# EAGLE design nucleo_board (EAGLE 9.6.2)
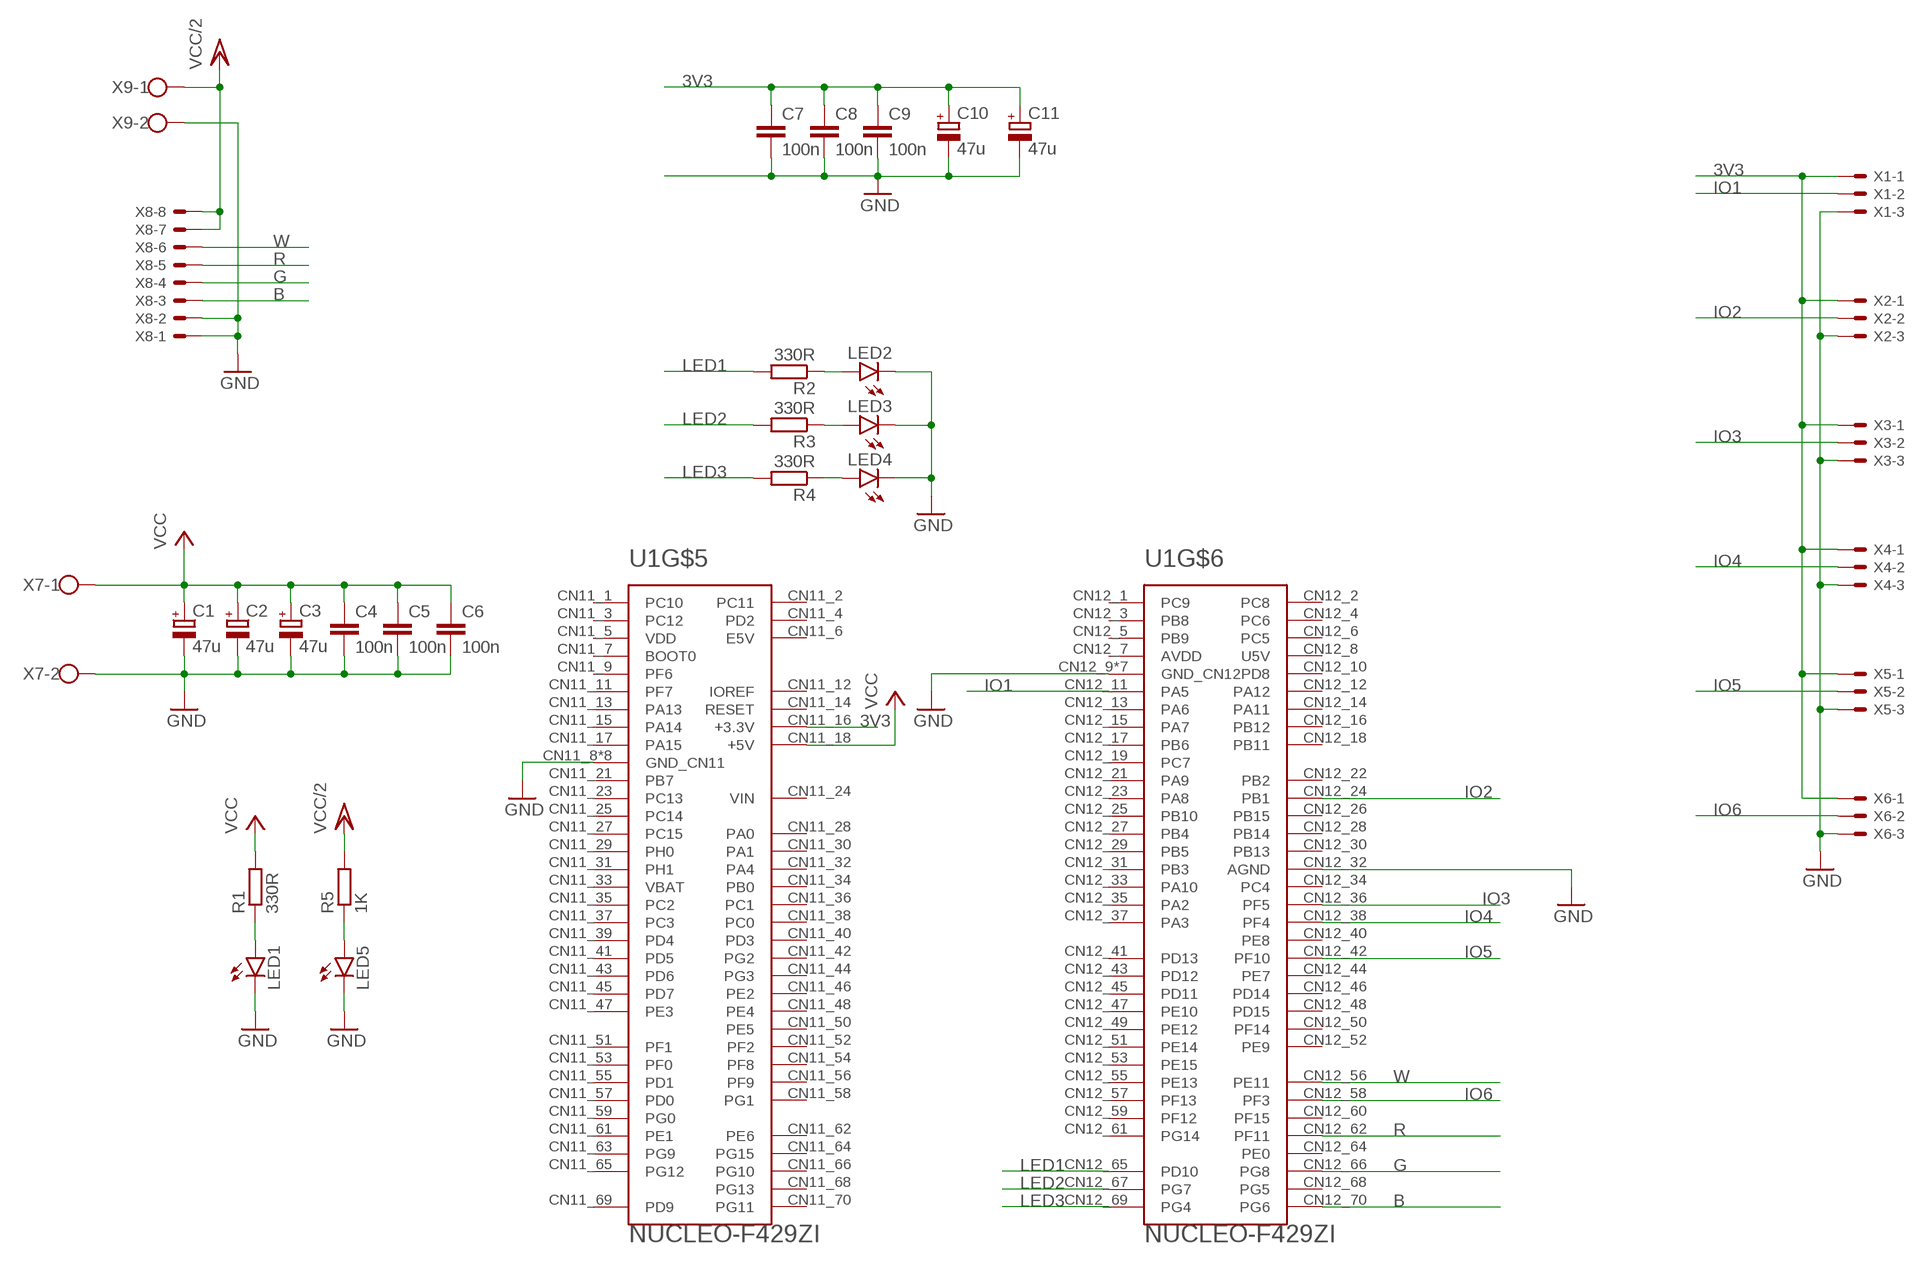
[diagram p0: schematic, sheet 1]

## Parts
C1  47u  CPOL-EU153CLV-1010  [153CLV-1010]
C2  47u  CPOL-EU153CLV-1010  [153CLV-1010]
C3  47u  CPOL-EU153CLV-1010  [153CLV-1010]
C4  100n  C-EUC1206  [C1206]
C5  100n  C-EUC1206  [C1206]
C6  100n  C-EUC1206  [C1206]
C7  100n  C-EUC1206  [C1206]
C8  100n  C-EUC1206  [C1206]
C9  100n  C-EUC1206  [C1206]
C10  47u  CPOL-EU153CLV-1010  [153CLV-1010]
C11  47u  CPOL-EU153CLV-1010  [153CLV-1010]
LED1  LEDCHIPLED_1206  [CHIPLED_1206]
LED2  LEDCHIPLED_1206  [CHIPLED_1206]
LED3  LEDCHIPLED_1206  [CHIPLED_1206]
LED4  LEDCHIPLED_1206  [CHIPLED_1206]
LED5  LEDCHIPLED_1206  [CHIPLED_1206]
R1  330R  R-EU_M1206  [M1206]
R2  330R  R-EU_M1206  [M1206]
R3  330R  R-EU_M1206  [M1206]
R4  330R  R-EU_M1206  [M1206]
R5  1K  R-EU_M1206  [M1206]
U1  NUCLEO-F429ZI  [MODULE_NUCLEO-F429ZI]
X1  KK-156-3  [KK-156-3]
X2  KK-156-3  [KK-156-3]
X3  KK-156-3  [KK-156-3]
X4  KK-156-3  [KK-156-3]
X5  KK-156-3  [KK-156-3]
X6  KK-156-3  [KK-156-3]
X7  W237-102  [W237-102]
X8  KK-156-8  [KK-156-8]
X9  W237-102  [W237-102]

## Nets
3V3: C7.1 C8.1 C9.1 C10.+ C11.+ U1.CN11_16(+3.3V) X1.1 X2.1 X3.1 X4.1 X5.1 X6.1
B: U1.CN12_70(PG6) X8.3
G: U1.CN12_66(PG8) X8.4
GND: C1.- C2.- C3.- C4.2 C5.2 C6.2 C7.2 C8.2 C9.2 C10.- C11.- LED1.C LED2.C LED3.C LED4.C LED5.C U1.CN11_8(GND_CN11) U1.CN11_19(GND_CN11) U1.CN11_20(GND_CN11) U1.CN11_22(GND_CN11) U1.CN11_49(GND_CN11) U1.CN11_60(GND_CN11) U1.CN11_71(GND_CN11) U1.CN11_72(GND_CN11) U1.CN12_9(GND_CN12) U1.CN12_20(GND_CN12) U1.CN12_32(AGND) U1.CN12_39(GND_CN12) U1.CN12_54(GND_CN12) U1.CN12_63(GND_CN12) U1.CN12_71(GND_CN12) U1.CN12_72(GND_CN12) X1.3 X2.3 X3.3 X4.3 X5.3 X6.3 X7.2 X8.1 X8.2 X9.2
IO1: U1.CN12_11(PA5) X1.2
IO2: U1.CN12_24(PB1) X2.2
IO3: U1.CN12_36(PF5) X3.2
IO4: U1.CN12_38(PF4) X4.2
IO5: U1.CN12_42(PF10) X5.2
IO6: U1.CN12_58(PF3) X6.2
LED1: R2.2 U1.CN12_65(PD10)
LED2: R3.2 U1.CN12_67(PG7)
LED3: R4.2 U1.CN12_69(PG4)
N$1: LED1.A R1.1
N$2: LED5.A R5.1
N$3: LED3.A R3.1
N$8: LED4.A R4.1
N$9: LED2.A R2.1
R: U1.CN12_62(PF11) X8.5
VCC: C1.+ C2.+ C3.+ C4.1 C5.1 C6.1 R1.2 U1.CN11_18(+5V) X7.1
VCC/2: R5.2 X8.7 X8.8 X9.1
W: U1.CN12_56(PE11) X8.6
Unconnected: U1.CN7_1(D16/PC6/I2S_A_MCK) U1.CN7_2(D15/PB8/I2C_A_SCL) U1.CN7_3(D17/PB15/I2S_A_SD) U1.CN7_4(D14/PB9/I2C_A_SDA) U1.CN7_5(D18/PB13/I2S_A_CK) U1.CN7_6(AVDD) U1.CN7_7(D19/PB12/I2S_A_WS) U1.CN7_8(GND_CN7) U1.CN7_9(D20/PA15/I2S_B_WS) U1.CN7_10(D13/PA5/SPI_A_SCK) U1.CN7_11(D21/PC7/I2S_B_MCK) U1.CN7_12(D12/PA6/SPI_A_MISO) U1.CN7_13(D22/PB5/I2S_B_SD/SPI_B_MOSI) U1.CN7_14(D11/ETH/PA7/SPI_A_MOSI/TIM_E_PWM1) U1.CN7_15(D23/PB3/I2S_B_CK/SPI_B_SCK) U1.CN7_16(D10/PD14/SPI_A_CS/TIM_B_PWM3) U1.CN7_17(D24/PA4/SPI_B_NSS) U1.CN7_18(D9/PD15/TIMER_B_PWM2) U1.CN7_19(D25/PB4/SPI_B_MISO) U1.CN7_20(D8/PF12) U1.CN8_2(D43/PC8/SDMMC_D0) U1.CN8_3(IOREF) U1.CN8_4(D44/PC9/SDMMC_D1/I2S_A_CKIN) U1.CN8_5(RESET) U1.CN8_6(D45/PC10/SDMMC_D2) U1.CN8_7(+3.3V) U1.CN8_8(D46/PC11/SDMMC_D3) U1.CN8_9(+5V) U1.CN8_10(D47/PC12/SDMMC_CK) U1.CN8_11(GND_CN8) U1.CN8_12(D48/PD2/SDMMC_CMD) U1.CN8_13(GND_CN8) U1.CN8_14(D49/PG2) U1.CN8_15(VIN) U1.CN8_16(D50/PG3) U1.CN9_1(A0/PA3) U1.CN9_2(D51/PD7/USART_B_SCLK) U1.CN9_3(A1/PC0) U1.CN9_4(D52/PD6/USART_B_RX) U1.CN9_5(A2/PC3) U1.CN9_6(D53/PD5/USART_B_TX) U1.CN9_7(A3/PF3) U1.CN9_8(D54/PD4/USART_B_RTS) U1.CN9_9(A4/PF5) U1.CN9_10(D55/PD3/USART_B_CTS) U1.CN9_11(A5/PF10) U1.CN9_12(GND_CN9) U1.CN9_13(D72/NC) U1.CN9_14(D56/PE2/SAI_A_MCLK) U1.CN9_15(D71/PA7) U1.CN9_16(D57/PE4/SAI_A_FS) U1.CN9_17(D70/PF2/I2C_B_SMBA) U1.CN9_18(D58/PE5/SAI_A_SCK) U1.CN9_19(D69/PF1/I2C_B_SCL) U1.CN9_20(D59/PE6/SAI_A_SD) U1.CN9_21(D68/PF0/I2C_B_SDA) U1.CN9_22(D60/PE3/SAI_B_SD) U1.CN9_23(GND_CN9) U1.CN9_24(D61/PF8/SAI_B_SCK) U1.CN9_25(D67/PD0/CAN_RX) U1.CN9_26(D62/PF7/SAI_B_MCLK) U1.CN9_27(D66/PD1/CAN_TX) U1.CN9_28(D63/PF9/SAI_B_FS) U1.CN9_29(D65/PG0) U1.CN9_30(D64/PG1) U1.CN10_1(AVDD) U1.CN10_2(D7/PF13) U1.CN10_3(AGND) U1.CN10_4(D6/PE9/TIMER_A_PWM1) U1.CN10_5(GND_CN10) U1.CN10_6(D5/PE11/TIMER_A_PWM2) U1.CN10_7(A6/PB1/ADC_A_IN) U1.CN10_8(D4/PF14) U1.CN10_9(A7/PC2/ADC_B_IN) U1.CN10_10(D3/PE13/TIMER_A_PWM3) U1.CN10_11(A8/PF4/ADC_C_IN) U1.CN10_12(D2/PF15) U1.CN10_13(D26/PB6) U1.CN10_14(D1/PG14/USART_A_TX) U1.CN10_15(D27/PB2) U1.CN10_16(D0/PG9/USART_A_RX) U1.CN10_17(GND_CN10) U1.CN10_18(D42/PE8/TIMER_A_PWM1N) U1.CN10_19(D28/PD13) U1.CN10_20(D41/PE7/TIMER_A_ETR) U1.CN10_21(D29/PD12) U1.CN10_22(GND_CN10) U1.CN10_23(D30/PD11) U1.CN10_24(D40/PE10/TIMER_A_PWM2N) U1.CN10_25(D31/PE2) U1.CN10_26(D39/PE12/TIMER_A_PWM3N) U1.CN10_27(GND_CN10) U1.CN10_28(D38/PE14) U1.CN10_29(D32/PA0/TIMER_C_PWM1) U1.CN10_30(D37/PE15/TIMER_A_BKIN1) U1.CN10_31(D33/PB0/TIMER_D_PWM1) U1.CN10_32(D36/PB10/TIMER_C_PWM2) U1.CN10_33(D34/PE0/TIMER_B_ETR) U1.CN10_34(D35/PB11/TIMER_C_PWM3) U1.CN11_1(PC10) U1.CN11_2(PC11) U1.CN11_3(PC12) U1.CN11_4(PD2) U1.CN11_5(VDD) U1.CN11_6(E5V) U1.CN11_7(BOOT0) U1.CN11_9(PF6) U1.CN11_11(PF7) U1.CN11_12(IOREF) U1.CN11_13(PA13) U1.CN11_14(RESET) U1.CN11_15(PA14) U1.CN11_17(PA15) U1.CN11_21(PB7) U1.CN11_23(PC13) U1.CN11_24(VIN) U1.CN11_25(PC14) U1.CN11_27(PC15) U1.CN11_28(PA0) U1.CN11_29(PH0) U1.CN11_30(PA1) U1.CN11_31(PH1) U1.CN11_32(PA4) U1.CN11_33(VBAT) U1.CN11_34(PB0) U1.CN11_35(PC2) U1.CN11_36(PC1) U1.CN11_37(PC3) U1.CN11_38(PC0) U1.CN11_39(PD4) U1.CN11_40(PD3) U1.CN11_41(PD5) U1.CN11_42(PG2) U1.CN11_43(PD6) U1.CN11_44(PG3) U1.CN11_45(PD7) U1.CN11_46(PE2) U1.CN11_47(PE3) U1.CN11_48(PE4) U1.CN11_50(PE5) U1.CN11_51(PF1) U1.CN11_52(PF2) U1.CN11_53(PF0) U1.CN11_54(PF8) U1.CN11_55(PD1) U1.CN11_56(PF9) U1.CN11_57(PD0) U1.CN11_58(PG1) U1.CN11_59(PG0) U1.CN11_61(PE1) U1.CN11_62(PE6) U1.CN11_63(PG9) U1.CN11_64(PG15) U1.CN11_65(PG12) U1.CN11_66(PG10) U1.CN11_68(PG13) U1.CN11_69(PD9) U1.CN11_70(PG11) U1.CN12_1(PC9) U1.CN12_2(PC8) U1.CN12_3(PB8) U1.CN12_4(PC6) U1.CN12_5(PB9) U1.CN12_6(PC5) U1.CN12_7(AVDD) U1.CN12_8(U5V) U1.CN12_10(PD8) U1.CN12_12(PA12) U1.CN12_13(PA6) U1.CN12_14(PA11) U1.CN12_15(PA7) U1.CN12_16(PB12) U1.CN12_17(PB6) U1.CN12_18(PB11) U1.CN12_19(PC7) U1.CN12_21(PA9) U1.CN12_22(PB2) U1.CN12_23(PA8) U1.CN12_25(PB10) U1.CN12_26(PB15) U1.CN12_27(PB4) U1.CN12_28(PB14) U1.CN12_29(PB5) U1.CN12_30(PB13) U1.CN12_31(PB3) U1.CN12_33(PA10) U1.CN12_34(PC4) U1.CN12_35(PA2) U1.CN12_37(PA3) U1.CN12_40(PE8) U1.CN12_41(PD13) U1.CN12_43(PD12) U1.CN12_44(PE7) U1.CN12_45(PD11) U1.CN12_46(PD14) U1.CN12_47(PE10) U1.CN12_48(PD15) U1.CN12_49(PE12) U1.CN12_50(PF14) U1.CN12_51(PE14) U1.CN12_52(PE9) U1.CN12_53(PE15) U1.CN12_55(PE13) U1.CN12_57(PF13) U1.CN12_59(PF12) U1.CN12_60(PF15) U1.CN12_61(PG14) U1.CN12_64(PE0) U1.CN12_68(PG5)

## Library data of the parts
C1-C3 C10 C11 = rcl:CPOL-EU: POLARIZED CAPACITOR, European symbol; SPICEPREFIX: C
C4-C9 = rcl:C-EU: CAPACITOR, European symbol; SPICEPREFIX: C
LED1-LED5 = led:LED: LED OSRAM: - CHIPLED LG R971, LG N971, LY N971, LG Q971, LY Q971, LO R971, LY R971 LH N974, LH R974 LS Q976, LO Q976, LY Q976 LO Q996 - Hyper CHIPLED LW Q18S LB Q993, LB Q99A, LB R99A - SideLED LS A670, LO A670, LY A670, LG A670, LP A670 LB A673, LV A673, LT A673, LW A673 LH A674 LY A675 LS A676, LA A676, LO A676, LY A676, LW A676 LS A679, LY A679, LG A679 - Hyper Micro SIDELED® LS Y876, LA Y876, LO Y876, LY Y876 LT Y87S - SmartLED LW L88C, LW L88S LB L89C, LB L89S, LG L890 LS L89K, LO L89K, LY L89K LS L896, LA L896, LO L896, LY L896 - TOPLED LS T670, LO T670, LY T670, LG T670, LP T670 LSG T670, LSP T670, LSY T670, LOP T670, LYG T670 LG T671, LOG T671, LSG T671 LB T673, LV T673, LT T673, LW T673 LH T674 LS T676, LA T676, LO T676, LY T676, LB T676, LH T676, LSB T676, LW T676 LB T67C, LV T67C, LT T67C, LS T67K, LO T67K, LY T67K, LW E67C LS E67B, LA E67B, LO E67B, LY E67B, LB E67C, LV E67C, LT E67C LW T67C LS T679, LY T679, LG T679 LS T770, LO T770, LY T770, LG T770, LP T770 LB T773, LV T773, LT T773, LW T773 LH T774 LS E675, LA E675, LY E675, LS T675 LS T776, LA T776, LO T776, LY T776, LB T776 LHGB T686 LT T68C, LB T68C - Hyper Mini TOPLED® LB M676 - Mini TOPLED Santana® LG M470 LS M47K, LO M47K, LY M47K Source: http://www.osram.convergy.de LUXEON: - LUMILED® LXK2-PW12-R00, LXK2-PW12-S00, LXK2-PW14-U00, LXK2-PW14-V00 LXK2-PM12-R00, LXK2-PM12-S00, LXK2-PM14-U00 LXK2-PE12-Q00, LXK2-PE12-R00, LXK2-PE12-S00, LXK2-PE14-T00, LXK2-PE14-U00 LXK2-PB12-K00, LXK2-PB12-L00, LXK2-PB12-M00, LXK2-PB14-N00, LXK2-PB14-P00, LXK2-PB14-Q00 LXK2-PR12-L00, LXK2-PR12-M00, LXK2-PR14-Q00, LXK2-PR14-R00 LXK2-PD12-Q00, LXK2-PD12-R00, LXK2-PD12-S00 LXK2-PH12-R00, LXK2-PH12-S00 LXK2-PL12-P00, LXK2-PL12-Q00, LXK2-PL12-R00 Source: www.luxeon.com KINGBRIGHT: KA-3528ASYC Source: www.kingbright.com
R1-R5 = rcl:R-EU_: RESISTOR, European symbol; SPICEPREFIX: R
U1 = NUCLEO-F429ZI:NUCLEO-F429ZI: STM32 Nucleo-144 development board with STM32F429ZIT6 MCU, supports Arduino, ST Zio and Morpho; DESCRIPTION: STM32 Nucleo-144 development board with STM32F429ZIT6 MCU, supports Arduino, ST Zio and Morpho; DIGI-KEY_PART_NUMBER: 497-16280-ND; DIGI-KEY_PURCHASE_URL: https://www.digikey.com/product-detail/en/stmicroelectronics/NUCLEO-F429ZI/497-16280-ND/5806777?utm_source=snapeda&utm_medium=aggregator&utm_campaign=symbol; MF: STMicroelectronics; MP: NUCLEO-F429ZI; PACKAGE: None
X1-X6 = con-molex:KK-156-3: KK 156 HEADER Source: http://www.molex.com/pdm_docs/sd/026604100_sd.pdf; MF: MOLEX; OC_FARNELL: unknown; OC_NEWARK: unknown
X7 X9 = con-wago-500:W237-102: WAGO SCREW CLAMP; MPN: 237-102; OC_FARNELL: unknown; OC_NEWARK: 70K9898
X8 = con-molex:KK-156-8: KK 156 HEADER Source: http://www.molex.com/pdm_docs/sd/026604100_sd.pdf; MF: MOLEX; OC_FARNELL: unknown; OC_NEWARK: unknown

## Board
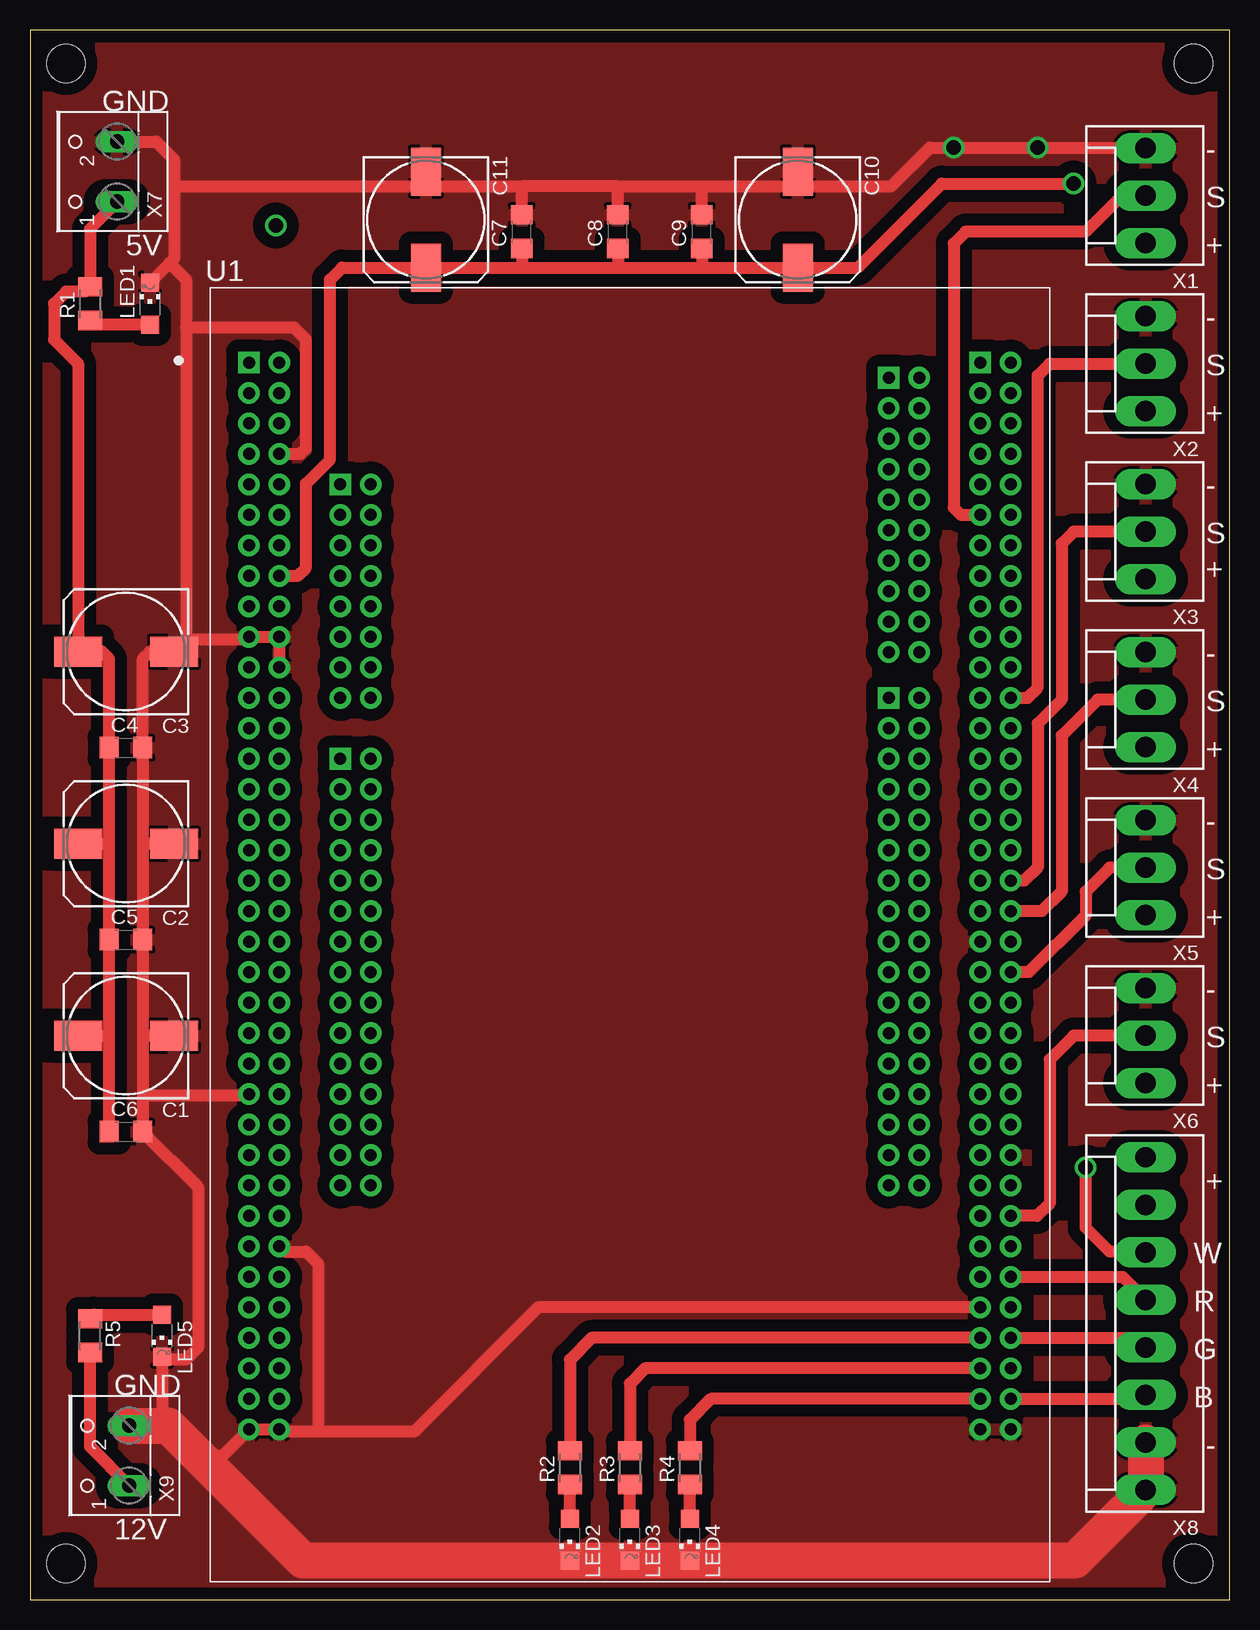
[diagram p1: board, top side]
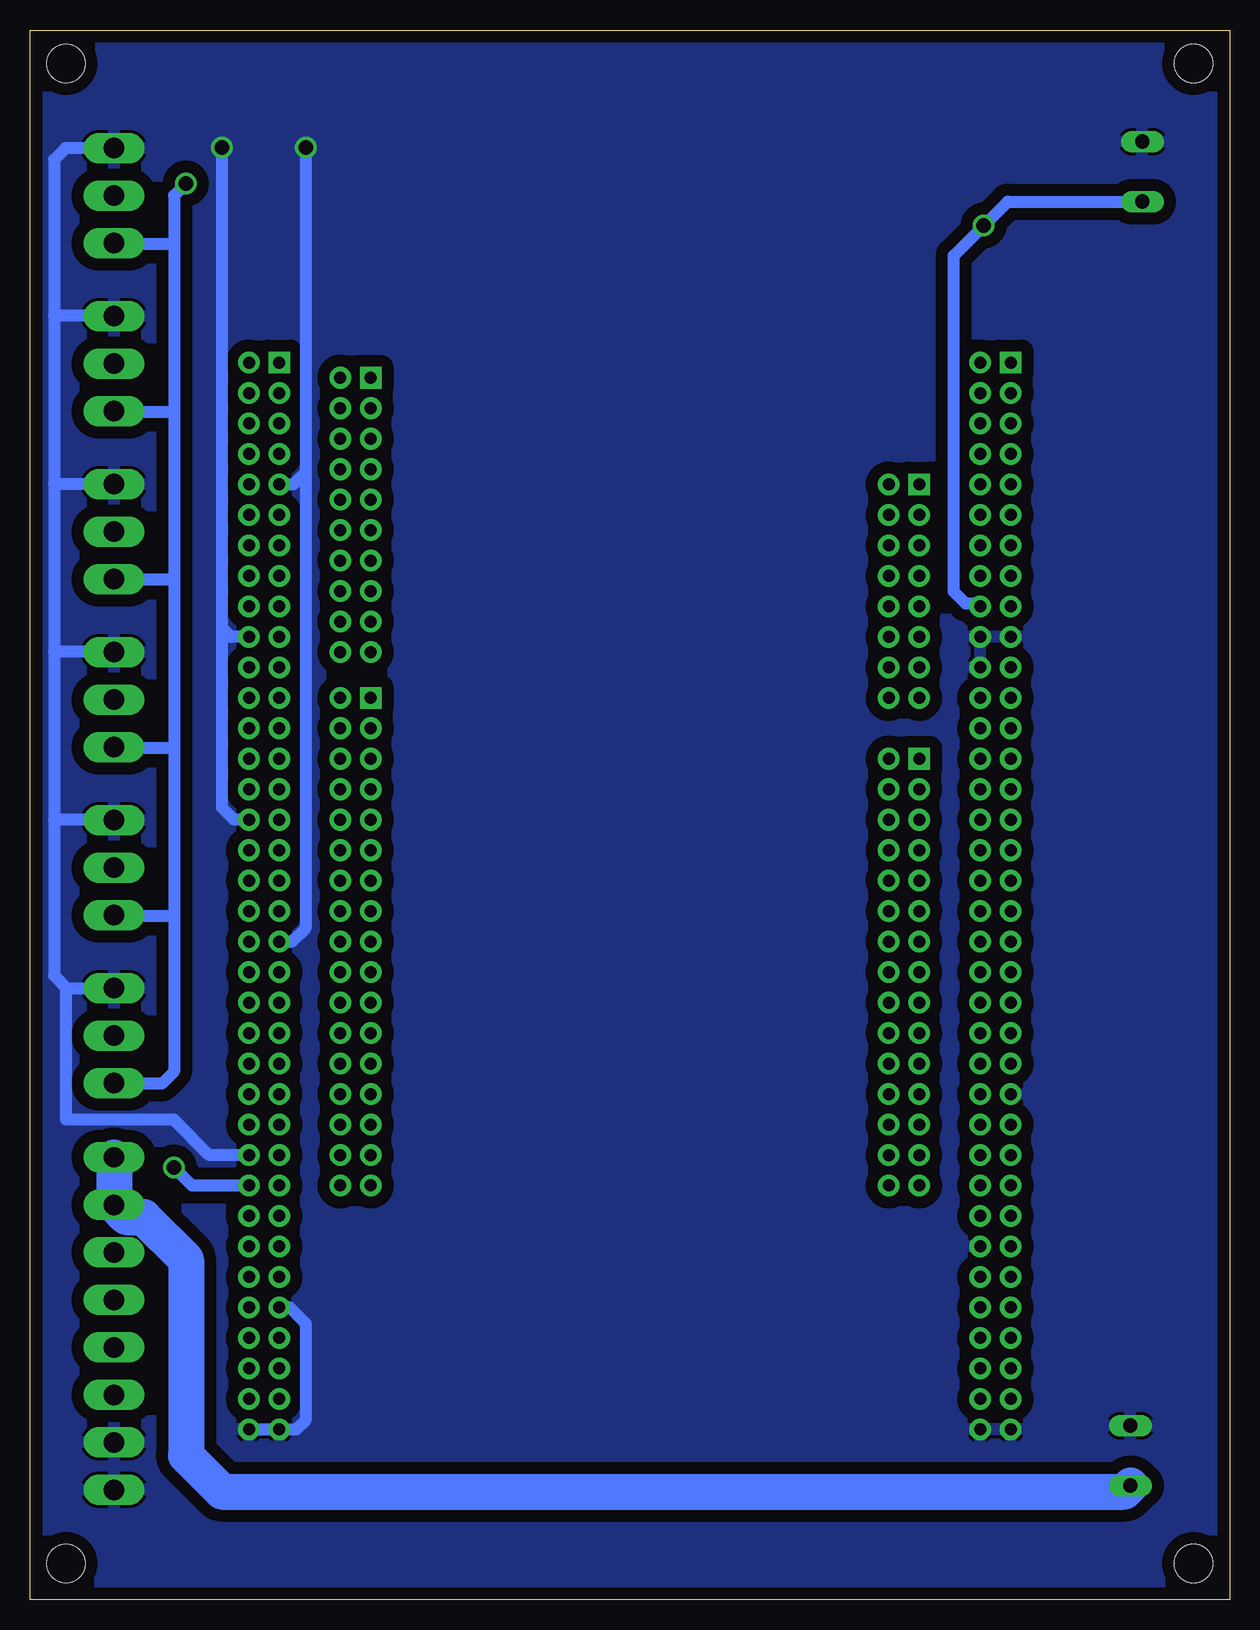
[diagram p2: board, bottom side, seen from below]

Size 100 x 130.8 mm. Coordinates in mm from the lower left corner, seen from the top.
Outline: 0,0 100,0 100,130.8 0,130.8 0,0
Copper layers (1*16): Top 0.035mm / dielectric 1.5mm / Bottom 0.035mm
Design rules "default": minimum track width 6mil, minimum drill 0.35mm, track to track 6mil, track to pad 6mil, pad to pad 6mil, via to via 6mil, smd to smd 6mil, copper to edge 40mil, drill to drill 6mil, minimum pad ring 10mil, minimum via ring 8mil, stop-mask expansion 4mil, vias tented up to drill 0mil, thermal gap 10mil
Holes 3.2 mm at 97,3 3,3 3,128 97,128

### Footprints (pad centres in the part's own frame; a part is rotated, then mirrored left to right if it is on the bottom)
153CLV-1010 = smd 4 x 2.5: + 4,0; - -4,0
C1206 = smd 1.6 x 1.8: 1 -1.4,0; 2 1.4,0
CHIPLED_1206 = smd 1.5 x 1.5: A 0,-1.75; C 0,1.75
M1206 = smd 1.6 x 2: 1 -1.4,0; 2 1.4,0
MODULE_NUCLEO-F429ZI = drill 1 pad 1.8 square: CN7_1 21.59,43.82; CN8_1 -24.13,34.93; CN9_1 -24.13,12.07; CN10_1 21.59,17.15; CN11_1 -31.75,45.09; CN12_1 29.21,45.09 | drill 1 pad 1.8: CN7_2 24.13,43.82; CN7_3 21.59,41.28; CN7_4 24.13,41.28; CN7_5 21.59,38.74; CN7_6 24.13,38.74; CN7_7 21.59,36.2; CN7_8 24.13,36.2; CN7_9 21.59,33.66; CN7_10 24.13,33.66; CN7_11 21.59,31.12; CN7_12 24.13,31.12; CN7_13 21.59,28.58; CN7_14 24.13,28.58; CN7_15 21.59,26.04; CN7_16 24.13,26.04; CN7_17 21.59,23.5; CN7_18 24.13,23.5; CN7_19 21.59,20.96; CN7_20 24.13,20.96; CN8_2 -21.59,34.93; CN8_3 -24.13,32.39; CN8_4 -21.59,32.39; CN8_5 -24.13,29.85; CN8_6 -21.59,29.85; CN8_7 -24.13,27.31; CN8_8 -21.59,27.31; CN8_9 -24.13,24.77; CN8_10 -21.59,24.77; CN8_11 -24.13,22.23; CN8_12 -21.59,22.23; CN8_13 -24.13,19.69; CN8_14 -21.59,19.69; CN8_15 -24.13,17.15; CN8_16 -21.59,17.15; CN9_2 -21.59,12.07; CN9_3 -24.13,9.53; CN9_4 -21.59,9.53; CN9_5 -24.13,6.99; CN9_6 -21.59,6.99; CN9_7 -24.13,4.45; CN9_8 -21.59,4.45; CN9_9 -24.13,1.91; CN9_10 -21.59,1.91; CN9_11 -24.13,-0.63; CN9_12 -21.59,-0.63; CN9_13 -24.13,-3.17; CN9_14 -21.59,-3.17; CN9_15 -24.13,-5.71; CN9_16 -21.59,-5.71; CN9_17 -24.13,-8.25; CN9_18 -21.59,-8.25; CN9_19 -24.13,-10.79; CN9_20 -21.59,-10.79; CN9_21 -24.13,-13.33; CN9_22 -21.59,-13.33; CN9_23 -24.13,-15.87; CN9_24 -21.59,-15.87; CN9_25 -24.13,-18.41; CN9_26 -21.59,-18.41; CN9_27 -24.13,-20.95; CN9_28 -21.59,-20.95; CN9_29 -24.13,-23.49; CN9_30 -21.59,-23.49; CN10_2 24.13,17.15; CN10_3 21.59,14.61; CN10_4 24.13,14.61; CN10_5 21.59,12.07; CN10_6 24.13,12.07; CN10_7 21.59,9.53; CN10_8 24.13,9.53; CN10_9 21.59,6.99; CN10_10 24.13,6.99; CN10_11 21.59,4.45; CN10_12 24.13,4.45; CN10_13 21.59,1.91; CN10_14 24.13,1.91; CN10_15 21.59,-0.63; CN10_16 24.13,-0.63; CN10_17 21.59,-3.17; CN10_18 24.13,-3.17; CN10_19 21.59,-5.71; CN10_20 24.13,-5.71; CN10_21 21.59,-8.25; CN10_22 24.13,-8.25; CN10_23 21.59,-10.79; CN10_24 24.13,-10.79; CN10_25 21.59,-13.33; CN10_26 24.13,-13.33; CN10_27 21.59,-15.87; CN10_28 24.13,-15.87; CN10_29 21.59,-18.41; CN10_30 24.13,-18.41; CN10_31 21.59,-20.95; CN10_32 24.13,-20.95; CN10_33 21.59,-23.49; CN10_34 24.13,-23.49; CN11_2 -29.21,45.09; CN11_3 -31.75,42.55; CN11_4 -29.21,42.55; CN11_5 -31.75,40.01; CN11_6 -29.21,40.01; CN11_7 -31.75,37.47; CN11_8 -29.21,37.47; CN11_9 -31.75,34.93; CN11_10 -29.21,34.93; CN11_11 -31.75,32.39; CN11_12 -29.21,32.39; CN11_13 -31.75,29.85; CN11_14 -29.21,29.85; CN11_15 -31.75,27.31; CN11_16 -29.21,27.31; CN11_17 -31.75,24.77; CN11_18 -29.21,24.77; CN11_19 -31.75,22.23; CN11_20 -29.21,22.23; CN11_21 -31.75,19.69; CN11_22 -29.21,19.69; CN11_23 -31.75,17.15; CN11_24 -29.21,17.15; CN11_25 -31.75,14.61; CN11_26 -29.21,14.61; CN11_27 -31.75,12.07; CN11_28 -29.21,12.07; CN11_29 -31.75,9.53; CN11_30 -29.21,9.53; CN11_31 -31.75,6.99; CN11_32 -29.21,6.99; CN11_33 -31.75,4.45; CN11_34 -29.21,4.45; CN11_35 -31.75,1.91; CN11_36 -29.21,1.91; CN11_37 -31.75,-0.63; CN11_38 -29.21,-0.63; CN11_39 -31.75,-3.17; CN11_40 -29.21,-3.17; CN11_41 -31.75,-5.71; CN11_42 -29.21,-5.71; CN11_43 -31.75,-8.25; CN11_44 -29.21,-8.25; CN11_45 -31.75,-10.79; CN11_46 -29.21,-10.79; CN11_47 -31.75,-13.33; CN11_48 -29.21,-13.33; CN11_49 -31.75,-15.87; CN11_50 -29.21,-15.87; CN11_51 -31.75,-18.41; CN11_52 -29.21,-18.41; CN11_53 -31.75,-20.95; CN11_54 -29.21,-20.95; CN11_55 -31.75,-23.49; CN11_56 -29.21,-23.49; CN11_57 -31.75,-26.03; CN11_58 -29.21,-26.03; CN11_59 -31.75,-28.57; CN11_60 -29.21,-28.57; CN11_61 -31.75,-31.11; CN11_62 -29.21,-31.11; CN11_63 -31.75,-33.65; CN11_64 -29.21,-33.65; CN11_65 -31.75,-36.19; CN11_66 -29.21,-36.19; CN11_67 -31.75,-38.73; CN11_68 -29.21,-38.73; CN11_69 -31.75,-41.27; CN11_70 -29.21,-41.27; CN11_71 -31.75,-43.81; CN11_72 -29.21,-43.81; CN12_2 31.75,45.09; CN12_3 29.21,42.55; CN12_4 31.75,42.55; CN12_5 29.21,40.01; CN12_6 31.75,40.01; CN12_7 29.21,37.47; CN12_8 31.75,37.47; CN12_9 29.21,34.93; CN12_10 31.75,34.93; CN12_11 29.21,32.39; CN12_12 31.75,32.39; CN12_13 29.21,29.85; CN12_14 31.75,29.85; CN12_15 29.21,27.31; CN12_16 31.75,27.31; CN12_17 29.21,24.77; CN12_18 31.75,24.77; CN12_19 29.21,22.23; CN12_20 31.75,22.23; CN12_21 29.21,19.69; CN12_22 31.75,19.69; CN12_23 29.21,17.15; CN12_24 31.75,17.15; CN12_25 29.21,14.61; CN12_26 31.75,14.61; CN12_27 29.21,12.07; CN12_28 31.75,12.07; CN12_29 29.21,9.53; CN12_30 31.75,9.53; CN12_31 29.21,6.99; CN12_32 31.75,6.99; CN12_33 29.21,4.45; CN12_34 31.75,4.45; CN12_35 29.21,1.91; CN12_36 31.75,1.91; CN12_37 29.21,-0.63; CN12_38 31.75,-0.63; CN12_39 29.21,-3.17; CN12_40 31.75,-3.17; CN12_41 29.21,-5.71; CN12_42 31.75,-5.71; CN12_43 29.21,-8.25; CN12_44 31.75,-8.25; CN12_45 29.21,-10.79; CN12_46 31.75,-10.79; CN12_47 29.21,-13.33; CN12_48 31.75,-13.33; CN12_49 29.21,-15.87; CN12_50 31.75,-15.87; CN12_51 29.21,-18.41; CN12_52 31.75,-18.41; CN12_53 29.21,-20.95; CN12_54 31.75,-20.95; CN12_55 29.21,-23.49; CN12_56 31.75,-23.49; CN12_57 29.21,-26.03; CN12_58 31.75,-26.03; CN12_59 29.21,-28.57; CN12_60 31.75,-28.57; CN12_61 29.21,-31.11; CN12_62 31.75,-31.11; CN12_63 29.21,-33.65; CN12_64 31.75,-33.65; CN12_65 29.21,-36.19; CN12_66 31.75,-36.19; CN12_67 29.21,-38.73; CN12_68 31.75,-38.73; CN12_69 29.21,-41.27; CN12_70 31.75,-41.27; CN12_71 29.21,-43.81; CN12_72 31.75,-43.81
KK-156-3 = drill 1.7 pad 2.184 long: 1 -3.96,0; 2 0,0; 3 3.96,0
W237-102 = drill 1.194 long: 1 -2.5,-1.27; 2 2.5,-1.27
KK-156-8 = drill 1.7 pad 2.184 long: 1 -13.86,0; 2 -9.9,0; 3 -5.94,0; 4 -1.98,0; 5 1.98,0; 6 5.94,0; 7 9.9,0; 8 13.86,0

### Placement (x,y rotation side)
C1  8,47 180 top
C2  8,63 180 top
C3  8,79 180 top
C4  8,71 0 top
C5  8,55 0 top
C6  8,39 0 top
C7  41,114 90 top
C8  49,114 90 top
C9  56,114 90 top
C10  64,115 270 top
C11  33,115 270 top
LED1  10,108 0 top
LED2  45,5 180 top
LED3  50,5 180 top
LED4  55,5 180 top
LED5  11,22 180 top
R1  5,108 90 top
R2  45,11 90 top
R3  50,11 90 top
R4  55,11 90 top
R5  5,22 270 top
U1  50,58 0 top
X1  93,117 90 top
X2  93,103 90 top
X3  93,89 90 top
X4  93,75 90 top
X5  93,61 90 top
X6  93,47 90 top
X7  6,119 90 top
X8  93,23 90 top
X9  7,12 90 top

### Tracks (layer width: path | path; a pad name or v marks a point on that pad's centre or on a via)
3V3  (via drill 1.2)
  Top 1: U1.CN11_16 22.31,85.31 23,86 23,93 25,95 25,110 26,111 C11.+ 41,111 | v87,118 76,118 69,111 C10.+ 56,111 | 41,111 49,111 | 49,111 56,111 | C7.1 41,111 | C8.1 49,111 | C9.1 56,111
  Bottom 1: v87,118 88,117 88,113 | X6.1 92.96,43 89,43 88,44 88,57 | 88,113 88,99 | 88,99 88,85 | 88,85 88,71 | 88,71 88,57 | X5.1 92.96,57 88,57 | X4.1 92.96,71 88,71 | X3.1 88.04,85.04 88,85 | X2.1 92.96,99 88,99 | X1.1 92.96,113 88,113
B
  Top 1: U1.CN12_70 92.67,16.73 X8.3
G
  Top 1: U1.CN12_66 92.21,21.81 X8.4
GND  (via drill 1.2)
  Top 1: 11.5,14.5 11,15 LED5.C 11.25,20 13,20 14,21 14,34.4 C6.2 9.4,42 | 15,11 15,12 16.06,12 U1.CN11_71 U1.CN11_72 20.98,14 24,14 | 9.4,63 C4.2 9.4,78.4 10,79 C3.- 13,80 | 9.4,63 C5.2 9.4,47 | 9.4,47 9.4,42 | C1.- 9.4,47 | C2.- 9.4,63 | U1.CN11_22 U1.CN11_20 U1.CN11_19 18.02,80 13,80 | 11.62,111.38 12,111.75 12,117.77 | 11.62,111.38 LED1.C | 11.62,111.38 13,110 13,106 | 13,106 13,80 | U1.CN11_8 22.53,95.47 23,95.94 23,105 22,106 13,106 | 12,117.77 41,117.77 | 49,117.77 41,117.77 | 49,117.77 56,117.77 | 56,117.77 71.77,117.77 75,121 v77,121 v84,121 92.96,121 X1.3 | U1.CN12_63 42.35,24.35 32,14 24,14 | U1.CN11_60 21.22,29 23,29 24,28 24,14 | U1.CN11_49 18.12,42 9.4,42 | X7.2 10.5,121.5 12,120 12,117.77 | C9.2 56,117.77 | C8.2 49,117.77 | C7.2 41,117.77
  Top 3: X8.2 X8.1 87.11,3.25 LED4.C LED3.C LED2.C 22.75,3.25 15,11 11.5,14.5 X9.2
  Bottom 1: X1.3 97.04,120.96 98,120 98,107 | 98,107 98,93 | 98,93 98,79 | 98,79 98,65 | 98,65 98,52 96.96,50.96 | 96.96,50.96 X6.3 | X5.3 93.04,65 98,65 | X2.3 93.04,107 98,107 | X3.3 97.96,92.96 98,93 | X4.3 93.04,79 98,79 | U1.CN12_32 83,65 84,66 84,81 | 84,81 v84,121 | U1.CN12_20 83.23,80.23 84,81 | U1.CN12_9 78.07,92.93 77,94 | 77,94 v77,121 | U1.CN12_39 78.17,54.83 77,56 77,94 | U1.CN12_72 U1.CN12_71 77.81,14.19 77,15 77,23 78.35,24.35 U1.CN12_63 | U1.CN12_54 85.05,37.05 88,40 97,40 97,50.92 96.96,50.96
  pour Top (isolate 1): 0,131 100,131 100,0 0,0
  pour Bottom (isolate 1): 0,131 100,131 100,0 0,0
IO1
  Top 1: U1.CN12_11 77.61,90.39 77,91 77,113 78,114 88,114 91,117 X1.2
IO2
  Top 1: U1.CN12_24 83.15,75.15 84,76 84,102 85,103 X2.2
IO3
  Top 1: X3.2 87,89 86,88 86,75 84,73 84,61 82.91,59.91 U1.CN12_36
IO4
  Top 1: X4.2 89,75 86,72 86,59 84.37,57.37 U1.CN12_38
IO5
  Top 1: X5.2 90,61 88,59 88,57 83.29,52.29 U1.CN12_42
IO6
  Top 1: U1.CN12_58 83.97,31.97 85,33 85,45 87,47 X6.2
LED1
  Top 1: U1.CN12_65 46.81,21.81 45,20 R2.2
LED2
  Top 1: U1.CN12_67 51.27,19.27 50,18 R3.2
LED3
  Top 1: U1.CN12_69 56.73,16.73 55,15 R4.2
N$1
  Top 1: LED1.A 5.35,106.25 R1.1
N$2
  Top 1: R5.1 5.35,23.75 LED5.A
N$3
  Top 1: LED3.A R3.1
N$8
  Top 1: LED4.A R4.1
N$9
  Top 1: LED2.A R2.1
R
  Top 1: U1.CN12_62 91.09,26.89 X8.5
VCC  (via drill 1.2)
  Top 1: C6.1 6.6,47 | 6.6,47 C5.1 6.6,63 | 6.6,63 C4.1 6.6,78.4 6,79 C3.+ 4,103 2,105 2,108 3,109 4.6,109 R1.2 5,114.23 X7.1 | C1.+ 6.6,47 | C2.+ 6.6,63
  Bottom 1: U1.CN11_18 21.02,83 22,83 23,84 23,112 v20.5,114.5 18.5,116.5 X7.1
VCC/2
  Top 1: X9.1 5,12.77 R5.2
  Bottom 3: X8.8 X8.7 91.97,31.87 90.51,31.87 87,28.36 87,12 84,9 8.77,9 X9.1
W  (via drill 1.2)
  Top 1: X8.6 92.94,29 90,29 88,31 v88,36
  Bottom 1: v88,36 86.51,34.51 U1.CN12_56

### Text on the board
tPlace: GND | - | S | 5V | + | - | S | + | - | S | + | - | S | + | - | S | + | - | S | + | + | W | R | G | GND | B | - | 12V